# Altium project template.PrjPcb
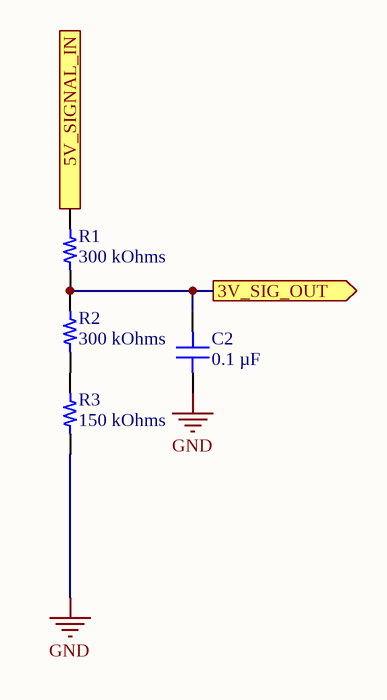
[diagram p0: 5V_TO_3V_VD.SchDoc]
12 sheets, 114 parts. Net scope: hierarchical (ports join the sheet entries above them; power ports are global).
Board file: PCB.PcbDoc
Sheets:
  5V_TO_3V_VD.SchDoc
  12V_SIGNAL_BULKHEAD.SchDoc
  5V_LS.SchDoc
  boardPower.SchDoc
    Buck = Buck.SchDoc
    LDO = LDO.SchDoc
  STM32.SchDoc
    CAN1 = CAN.SchDoc
    CAN2 = CAN.SchDoc
    Accelerometer And Gyro = IMU.SchDoc
  Connectors.SchDoc
  Debugger.SchDoc
    POWER = Power.SchDoc

## Sheet 5V_TO_3V_VD.SchDoc
size A4

### Parts
C2  0.1 µF  [CAP 0805_2012]
R1  300 kOhms  [RES 0805_2012]
R2  300 kOhms  [RES 0805_2012]
R3  150 kOhms  [RES 0805_2012]

### Ports
3V_SIG_OUT (out), 5V_SIGNAL_IN

### Nets
GND: C2.1 R3.1
NetC2_2: C2.2 R1.1 R2.2 ; port 3V_SIG_OUT
NetR1_2: R1.2 ; port 5V_SIGNAL_IN
NetR2_1: R2.1 R3.2

### Library data of the parts
C2 = CC0805MRX7R9BB104: CAP CER 0.1UF 50V X7R 0805; manufacturer: Yageo; Tolerance: ±20%; Part Number: CC0805MRX7R9BB104; Value: 0.1 µF; Applications: General Purpose; Capacitance: 0.1 µF; componentlink1description: Datasheet; componentlink1url: https://www.yageo.com/upload/media/product/productsearch/datasheet/mlcc/UPY-GPHC_X7R_6.3V-to-50V_18.pdf; componentlink2description: DigiKey Link; componentlink2url: https://www.digikey.com/en/products/detail/yageo/CC0805MRX7R9BB104/5884281; Device Package: 0805 (2012 Metric); lastupdated: 2023-10-02 7:13:07 PM; Lifecycle Status: Active; Minimum Order: 1; Mounting Type: Surface Mount, MLCC; Operating Temperature: -55°C ~ 125°C; Package / Case: 0805 (2012 Metric); packaging: TapeAndReel; partid: 2475; Part Status: Active; price: 0.01; series: CC; Size / Dimension: 0.079" L x 0.049" W (2.00mm x 1.25mm); Supplier 1: DigiKey; Supplier Part Number 1: 311-4351-1-ND; Temperature Coefficient: X7R; Thickness (Max): 0.037" (0.95mm); Voltage - Rated: 50V
R1 R2 = CRCW0805300KJNEA: RES SMD 300K OHM 5% 1/8W 0805; Manufacturer: Vishay Dale; Power (Watts): 0.125W, 1/8W; Temperature Coefficient: ±200ppm/°C; Part Number: CRCW0805300KJNEA; Value: 300 kOhms; ComponentLink1Description: Datasheet; ComponentLink1URL: http://www.vishay.com/docs/20035/dcrcwe3.pdf; ComponentLink2Description: DigiKey Link; ComponentLink2URL: https://www.digikey.com/en/products/detail/vishay-dale/CRCW0805300KJNEA/1175257; Composition: Thick Film; Device Package: 0805 (2012 Metric); Features: Automotive AEC-Q200; Height - Seated (Max): 0.020" (0.50mm); LastUpdated: 2023-10-02 7:52:37 PM; Lifecycle Status: Active; Minimum Order: 1; Number of Terminations: 2; Operating Temperature: -55°C ~ 155°C; Package / Case: 0805 (2012 Metric); Packaging: TapeAndReel; PartId: 29510; Part Status: Active; Price: 0.01; Ratings: AEC-Q200; Resistance: 300 kOhms; Series: CRCW; Size / Dimension: 0.079" L x 0.049" W (2.00mm x 1.25mm); Supplier 1: DigiKey; Supplier Part Number 1: 541-300KACT-ND; Supplier Device Package: 0805; Tolerance: ±5%
R3 = RT0805DRD07150KL: RES SMD 150K OHM 0.5% 1/8W 0805; Manufacturer: Yageo; Power (Watts): 0.125W, 1/8W; Temperature Coefficient: ±25ppm/°C; Part Number: RT0805DRD07150KL; Value: 150 kOhms; ComponentLink1Description: Datasheet; ComponentLink1URL: https://www.yageo.com/upload/media/product/productsearch/datasheet/rchip/PYu-RT_1-to-0.01_RoHS_L_11.pdf; ComponentLink2Description: DigiKey Link; ComponentLink2URL: https://www.digikey.com/en/products/detail/yageo/RT0805DRD07150KL/1077874; Composition: Thin Film; Device Package: 0805 (2012 Metric); Height - Seated (Max): 0.024" (0.60mm); LastUpdated: 2023-10-02 7:52:44 PM; Lifecycle Status: Active; Minimum Order: 1; Number of Terminations: 2; Operating Temperature: -55°C ~ 155°C; Package / Case: 0805 (2012 Metric); Packaging: TapeAndReel; PartId: 27806; Part Status: Active; Price: 0.02; Resistance: 150 kOhms; Series: RT; Size / Dimension: 0.079" L x 0.049" W (2.00mm x 1.25mm); Supplier 1: DigiKey; Supplier Part Number 1: 311-2706-1-ND; Supplier Device Package: 0805; Tolerance: ±0.5%

## Sheet 12V_SIGNAL_BULKHEAD.SchDoc
size A4
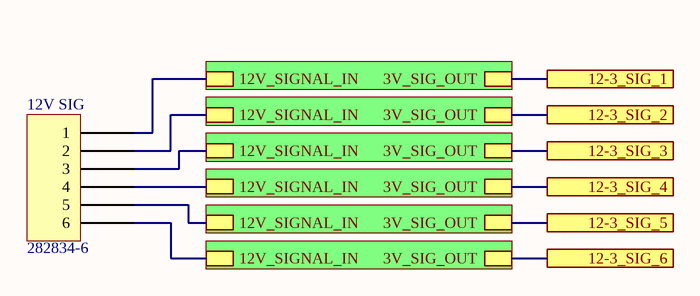
[diagram p1: 12V_SIGNAL_BULKHEAD.SchDoc]

### Parts
12V_SIG  282834-6  [TE 282834-6]

### Sub-sheets
? = 12_TO_3V3_VOLTAGE_DIVIDER.SchDoc (file not in this document): 12V_SIGNAL_IN, 3V_SIG_OUT
? = 12_TO_3V3_VOLTAGE_DIVIDER.SchDoc (file not in this document): 12V_SIGNAL_IN, 3V_SIG_OUT
? = 12_TO_3V3_VOLTAGE_DIVIDER.SchDoc (file not in this document): 12V_SIGNAL_IN, 3V_SIG_OUT
? = 12_TO_3V3_VOLTAGE_DIVIDER.SchDoc (file not in this document): 12V_SIGNAL_IN, 3V_SIG_OUT
? = 12_TO_3V3_VOLTAGE_DIVIDER.SchDoc (file not in this document): 12V_SIGNAL_IN, 3V_SIG_OUT
? = 12_TO_3V3_VOLTAGE_DIVIDER.SchDoc (file not in this document): 12V_SIGNAL_IN, 3V_SIG_OUT

### Ports
12-3_SIG_1, 12-3_SIG_2, 12-3_SIG_3, 12-3_SIG_4, 12-3_SIG_5, 12-3_SIG_6

### Nets
Net12V_SIG_1: 12V_SIG.1 ; sheet /12V_SIGNAL_IN
Net12V_SIG_2: 12V_SIG.2 ; sheet /12V_SIGNAL_IN
Net12V_SIG_3: 12V_SIG.3 ; sheet /12V_SIGNAL_IN
Net12V_SIG_4: 12V_SIG.4 ; sheet /12V_SIGNAL_IN
Net12V_SIG_5: 12V_SIG.5 ; sheet /12V_SIGNAL_IN
Net12V_SIG_6: 12V_SIG.6 ; sheet /12V_SIGNAL_IN
(unnamed): port 12-3_SIG_1, sheet /3V_SIG_OUT
(unnamed): port 12-3_SIG_2, sheet /3V_SIG_OUT
(unnamed): port 12-3_SIG_3, sheet /3V_SIG_OUT
(unnamed): port 12-3_SIG_4, sheet /3V_SIG_OUT
(unnamed): port 12-3_SIG_5, sheet /3V_SIG_OUT
(unnamed): port 12-3_SIG_6, sheet /3V_SIG_OUT

### Library data of the parts
12V_SIG = 282834-6: TERM BLK 6P SIDE ENT 2.54MM PCB; Manufacturer: TE Connectivity AMP Connectors; Current: 10A; Mating Orientation: Horizontal with Board; Number of Levels: 1; Pitch: 0.100" (2.54mm); Positions Per Level: 6; Voltage: 150V; Wire Gauge: 16-30 AWG; Wire Termination: Screw - Rising Cage Clamp; Part Number: 282834-6; Color: Green; ComponentLink1Description: Datasheet; ComponentLink1URL: https://www.te.com/commerce/DocumentDelivery/DDEController?Action=srchrtrv&DocNm=282834&DocType=Customer+Drawing&DocLang=English; ComponentLink2Description: DigiKey Link; ComponentLink2URL: http://digikey.com/product-detail/en/te-connectivity-amp-connectors/282834-6/A98337-ND/1153267; LastUpdated: 2020-01-15 4:16:31 AM; Lifecycle Status: Active; Minimum Order: 1; Mounting Type: Through Hole; Packaging: Bulk; Part Status: Active; Price: 4.72; Series: Buchanan; Supplier 1: DigiKey; Supplier Part Number 1: A98337-ND

## Sheet 5V_LS.SchDoc
size A4
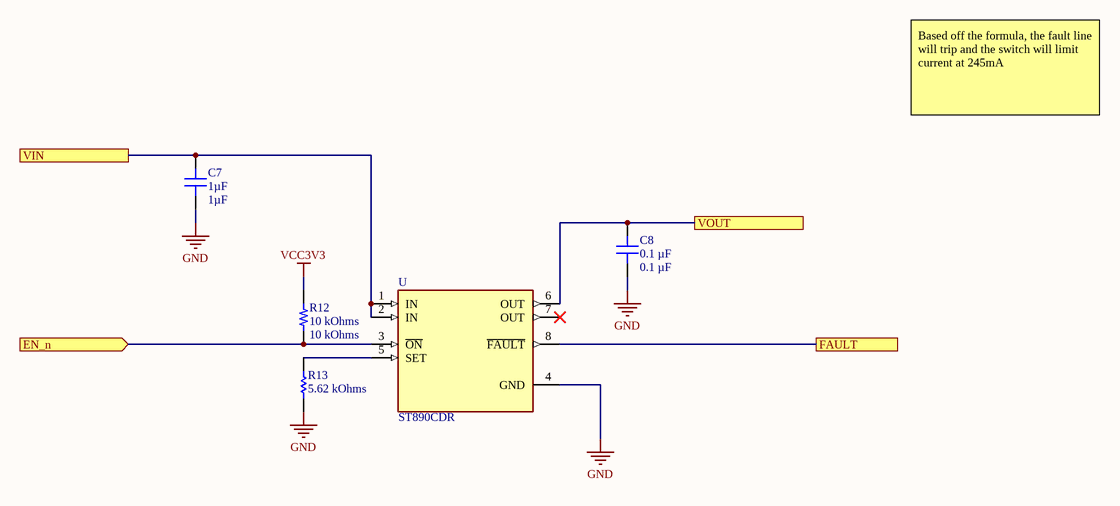
[diagram p2: 5V_LS.SchDoc]

### Parts
C7  1µF  [CAP 0805_2012]
C8  0.1 µF  [CAP 0805_2012]
R12  10 kOhms  [RES 0805_2012]
R13  5.62 kOhms  [RESC2013X60X40ML20T25]
U  ST890CDR  [SOIC127P600X175-8N]

### Ports
EN_n (in), FAULT, VIN, VOUT

### Nets
GND: C7.1 C8.1 R13.1 U.4(GND)
VCC3V3: R12.2
NetC7_2: C7.2 U.1(IN) U.2(IN) ; port VIN
NetC8_2: C8.2 U.6(OUT) ; port VOUT
NetR12_1: R12.1 U.3(~{ON}) ; port EN_n
NetR13_2: R13.2 U.5(SET)
NetU_8: U.8(~{FAULT}) ; port FAULT

Not connected (* = marked no-connect by the designer): U 7(OUT)*

### Notes on the sheet
- Based off the formula, the fault line will trip and the switch will limit current at 245mA

### Library data of the parts
C7 = MM05ZC105KCZ2A: CAP CER 1UF 10V X7R 0805; Part Number: MM05ZC105KCZ2A; Value: 1µF
C8 = CC0805MRX7R9BB104: CAP CER 0.1UF 50V X7R 0805; Part Number: CC0805MRX7R9BB104; Value: 0.1 µF
R12 = RNCS0805BKE10K0: RES 10K OHM 0.1% 1/10W 0805; Part Number: RNCS0805BKE10K0; Value: 10 kOhms
R13 = CMP-2001-00852-1: Part Number: ERA6AEB5621V; Manufacturer: Panasonic
U = ST890CDR: Power Switch/Driver 1:1 P-Channel 1.2A 8-SO; MF: STMicroelectronics; SnapEDA_Link: https://www.snapeda.com/parts/ST890CDR/STMicroelectronics/view-part/496092/?ref=snap; Availability: Unavailable; Price: None; MP: ST890CDR; Package: SOIC-8 STMicroelectronics; Value: *

## Sheet boardPower.SchDoc
size A4
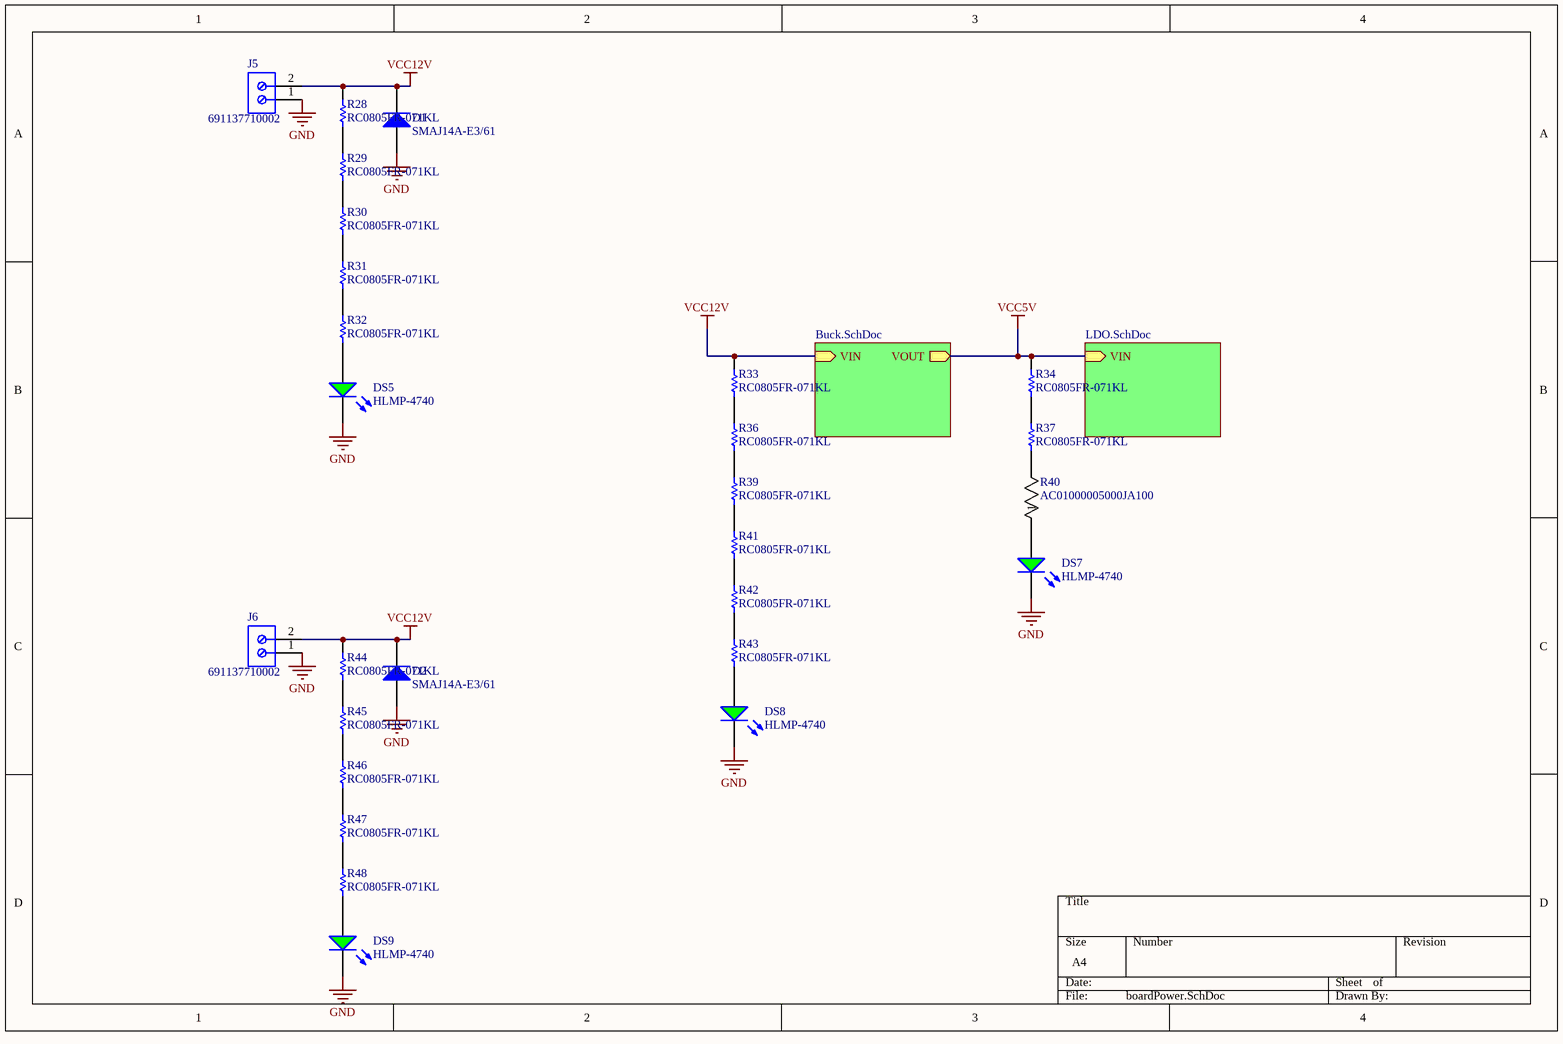
[diagram p3: boardPower.SchDoc]

### Parts
D1  SMAJ14A-E3/61  [VISH-DO-214AC-2_L]
D2  SMAJ14A-E3/61  [VISH-DO-214AC-2_L]
DS5  HLMP-4740  [AVAG-HLMP-4740]
DS7  HLMP-4740  [AVAG-HLMP-4740]
DS8  HLMP-4740  [AVAG-HLMP-4740]
DS9  HLMP-4740  [AVAG-HLMP-4740]
J5  691137710002  [691137710002]
J6  691137710002  [691137710002]
R28  RC0805FR-071KL  [RESC2013X60X35ML10T20]
R29  RC0805FR-071KL  [RESC2013X60X35ML10T20]
R30  RC0805FR-071KL  [RESC2013X60X35ML10T20]
R31  RC0805FR-071KL  [RESC2013X60X35ML10T20]
R32  RC0805FR-071KL  [RESC2013X60X35ML10T20]
R33  RC0805FR-071KL  [RESC2013X60X35ML10T20]
R34  RC0805FR-071KL  [RESC2013X60X35ML10T20]
R36  RC0805FR-071KL  [RESC2013X60X35ML10T20]
R37  RC0805FR-071KL  [RESC2013X60X35ML10T20]
R39  RC0805FR-071KL  [RESC2013X60X35ML10T20]
R40  AC01000005000JA100  [RES_AC01_VIS]
R41  RC0805FR-071KL  [RESC2013X60X35ML10T20]
R42  RC0805FR-071KL  [RESC2013X60X35ML10T20]
R43  RC0805FR-071KL  [RESC2013X60X35ML10T20]
R44  RC0805FR-071KL  [RESC2013X60X35ML10T20]
R45  RC0805FR-071KL  [RESC2013X60X35ML10T20]
R46  RC0805FR-071KL  [RESC2013X60X35ML10T20]
R47  RC0805FR-071KL  [RESC2013X60X35ML10T20]
R48  RC0805FR-071KL  [RESC2013X60X35ML10T20]

### Sub-sheets
Buck = Buck.SchDoc: VIN (in), VOUT (out)
LDO = LDO.SchDoc: VIN (in)

### Nets
GND: D1.2(A) D2.2(A) DS5.2(K) DS7.2(K) DS8.2(K) DS9.2(K) J5.1 J6.1 R34.2 ; sheet Buck/VOUT, sheet LDO/VIN  [also labelled VCC5V]
VCC12V: D1.1(K) D2.1(K) J5.2 J6.2 R28.2 R33.2 R44.2 ; sheet Buck/VIN
NetDS5_1: DS5.1(A) R32.1
NetDS7_1: DS7.1(A) R40.1
NetDS8_1: DS8.1(A) R43.1
NetDS9_1: DS9.1(A) R48.1
NetR28_1: R28.1 R29.2
NetR29_1: R29.1 R30.2
NetR30_1: R30.1 R31.2
NetR31_1: R31.1 R32.2
NetR33_1: R33.1 R36.2
NetR34_1: R34.1 R37.2
NetR36_1: R36.1 R39.2
NetR37_1: R37.1 R40.2
NetR39_1: R39.1 R41.2
NetR41_1: R41.1 R42.2
NetR42_1: R42.1 R43.2
NetR44_1: R44.1 R45.2
NetR45_1: R45.1 R46.2
NetR46_1: R46.1 R47.2
NetR47_1: R47.1 R48.2

### Library data of the parts
D1 D2 = CMP-0548-00224-2: Transient Voltage Suppressor, 6.40 to 231 V, 14 V Stand-off Voltage, Uni-Directional, -55 to 155 degC, 2-pin DO-214AC, Pb-Free, Tape and Reel; Manufacturer: Vishay Semiconductor; PPPM (W): 400, 300; VWM (V): 14; VBR Uni-Directional (V): 6.4 to 231; IFSM: 40 A; ID (uA): 1; PackageDescription: 2-Pin DO-214AC (SMA), Body 4.245 x 2.665 mm; ComponentLink2URL: http://www.vishay.com/docs/88390/smaj50a.pdf; Mounting Technology: Surface Mount; PartNumber: SMAJ14A-E3/61; Operating Junction and Storage Temperature Range: -55 to 150 degC; ComponentLink2Description: Datasheet; Packing: Tape and Reel; PackageReference: DO-214AC-2; ComponentLink3Description: Package Specification; ComponentLink1URL: http://www.vishay.com/; RoHS: TRUE; ComponentLink3URL: http://www.vishay.com/docs/88390/smaj50a.pdf; ComponentLink1Description: Manufacturer URL; DatasheetVersion: 12/8/2013
DS5 DS7-DS9 = CMP-2000-06413-1: T-1 3/4 (5 mm) Low Current LED Lamp, Green, 1.9 V, -20 to 100 degC, 2-Pin THD, RoHS, Bulk; Manufacturer: AvagoTechnologies; Type: Uni-Color; Peak Wavelength: 565nm; Rad Hard: No; Viewing Angle: 50°; Dominant Wavelength/Color Temperature: 569nm; Number of LEDs: 1; Lens Appearance: ColoredDiffused; Lens Shape Type: Circular; Mounting Orientation: TopMount; Intensity: 2.3mcd; Datasheet Version: 07/2014; Category: LEDs; Datasheet URL: http://docs.avagotech.com/docs/AV02-1557EN; Packaging: Bulk; Pin Count: 2; Mounting Technology: ThroughHole; Package Reference: HLMP-4740; Mounting: ThroughHole; Manufacturer URL: http://www.avagotech.com/; Color: Green; Package: 2T-13/4; Package Description: 2-Pin Through Hole Device, Dia 5.845 mm, Pitch 2.54 mm
J5 J6 = CMP-1502-03324-2: NexarPartId: 78871135; Voltage Rating: 300V; Number of Contacts: 2; Current Rating: 16A; Lead Pitch: 5mm; Height: 11.6mm; Packaging: Box; RoHS: Non-Compliant; Contact Material: Nickel, Tin; Max Operating Temperature: 120°C; Number of Pins: 2; Min Operating Temperature: -30°C; Number of Rows: 1
R28-R34 R36 R37 R39 R41-R48 = CMP-2100-03671-1: Chip Resistor, 1 KOhm, +/- 1%, 125 mW, -55 to 155 degC, 0805 (2012 Metric), RoHS, Tape and Reel; Manufacturer: Yageo; Temperature Coefficient: 100ppm/degreesC; Voltage Rating (DC): 150V; Max Power Dissipation: 125mW; Resistance: 1KOhm; Number of Pins: 2; Number of Terminations: 2; Datasheet URL: http://www.yageo.com/NewPortal/yageodocoutput?fileName=/pdf/R-Chip/PYu-RC_Group_51_RoHS_L_5.pdf; Length: 0.079inch; Package Description: 2-Pin Surface Mounted Device, Body 2 x 1.25 mm; Depth: 1.25mm; Height: 0.024inch; Military Standard: Not; Case/Package: 0805; Package Reference: 0805; RoHSCompliant: true; Lead Free: LeadFree; Packaging: TapeandReel; Package Quantity: 1; Datasheet Version: Rev. 5, 10/2016; Tolerance: 1%; Min Operating Temperature: -55degC; Voltage Rating: 150V; Composition: ThickFilm; Case Code (Imperial): 0805; Power Rating: 125mW; Width: 0.049inch; Case Code (Metric): 2012; Manufacturer URL: http://www.yageo.com/; Max Operating Temperature: 155degC; REACH SVHC: Unknown; Termination: SMD/SMT
R40 = CMP-00030-39746512-1: AC01000005000JA100 Res Wirewound 500 Ohm 5% 1W 100ppm/°C to 180ppm/°C Conformal AXL Thru-Hole Ammo Pack; Voltage Rating (DC): 22V; Lead Diameter: 800µm; Resistance: 500Ω; Weight: 519.986953mg; Number of Pins: 2; Min Operating Temperature: -40°C; Case/Package: Axial; Schedule B: 8533210080, 8533210080; Features: Flame Retardant Coating; Power Rating: 1W; Max Power Dissipation: 1W; Packaging: Tape & Box (TB); RoHS: Compliant; REACH SVHC: Unknown; NexarPartId: 39746512; Temperature Coefficient: 180ppm/°C; Diameter: 4.3mm; Contact Plating: Tin; Radiation Hardening: No; Max Operating Temperature: 275°C; Length: 11mm; Tolerance: 5%; Composition: Wirewound; Number of Terminations: 2; Termination: Axial; Voltage Rating: 22V

## Sheet Buck.SchDoc
size A4
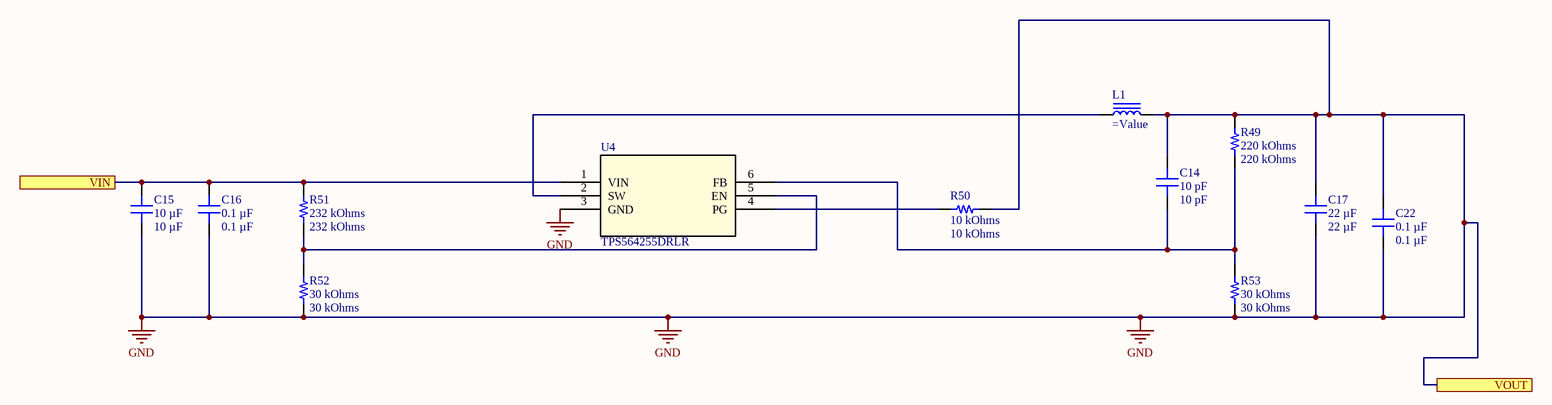
[diagram p4: Buck.SchDoc]

### Parts
C14  10 pF  [CAP 0805_2012]
C15  10 µF  [CAP 0805_2012]
C16  0.1 µF  [CAP 0805_2012]
C17  22 µF  [CAP 0805_2012]
C22  0.1 µF  [CAP 0805_2012]
L1  (no value)  [WURTH WE-PD 1245]
R49  220 kOhms  [RES 0805_2012]
R50  10 kOhms  [RES 0805_2012]
R51  232 kOhms  [RES 0805_2012]
R52  30 kOhms  [RES 0805_2012]
R53  30 kOhms  [RES 0805_2012]
U4  TPS564255DRLR  [TPS564242DRLR_TEX]

### Ports
VIN, VOUT

### Nets
GND: C14.2 C15.1 C16.1 C17.1 C17.2 C22.1 C22.2 L1.2 R49.2 R50.2 R52.1 R53.1 U4.3(GND) ; port VOUT
VCC12V: C15.2 C16.2 R51.2 U4.1(VIN) ; port VIN
NetC14_1: C14.1 R49.1 R53.2 U4.6(FB)
NetL1_1: L1.1 U4.2(SW)
NetR50_1: R50.1 U4.4(PG)
NetR51_1: R51.1 R52.2 U4.5(EN)

### Library data of the parts
C14 = GQM2195C2E100JB12D: CAP CER 10PF 250V C0G/NP0 0805; Part Number: GQM2195C2E100JB12D; Value: 10 pF
C15 = CL21Y106KPQVPNE: CAP CER 10UF 10V X7S 0805; Part Number: CL21Y106KPQVPNE; Value: 10 µF
C16 C22 = CC0805MRX7R9BB104: CAP CER 0.1UF 50V X7R 0805; Part Number: CC0805MRX7R9BB104; Value: 0.1 µF
C17 = CL21A226KOQNNNE: CAP CER 22UF 16V X5R 0805; Part Number: CL21A226KOQNNNE; Value: 22 µF
L1 = 7447715004: FIXED IND 4.7UH 5.2A 16 MOHM SMD; Part Number: 7447715004
R49 = CRGP0805F220K: RES 220K OHM 1% 1/3W 0805; Part Number: CRGP0805F220K; Value: 220 kOhms
R50 = RNCS0805BKE10K0: RES 10K OHM 0.1% 1/10W 0805; Part Number: RNCS0805BKE10K0; Value: 10 kOhms
R51 = CRCW0805232KFKEA: RES SMD 232K OHM 1% 1/8W 0805; Part Number: CRCW0805232KFKEA; Value: 232 kOhms
R52 R53 = RNCF0805DTE30K0: RES 30K OHM 0.5% 1/8W 0805; Part Number: RNCF0805DTE30K0; Value: 30 kOhms
U4 = TPS564255DRLR: No Description Available; Mfr_Name: Texas Instruments; Type: DEV; Copyright: Copyright (C) 2023 Ultra Librarian. All rights reserved.; Manufacturer_Part_Number: TPS564255DRLR; RefDes: RefDes

## Sheet LDO.SchDoc
size A4
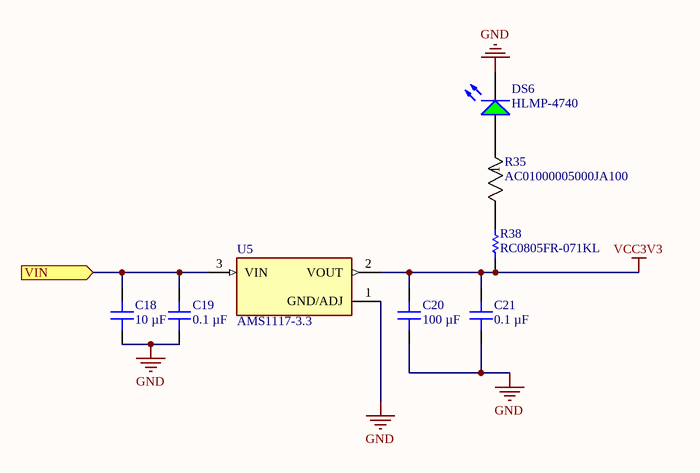
[diagram p5: LDO.SchDoc]

### Parts
C18  10 µF  [CAP 0805_2012]
C19  0.1 µF  [CAP 0805_2012]
C20  100 µF  [CAP 0805_2012]
C21  0.1 µF  [CAP 0805_2012]
DS6  HLMP-4740  [AVAG-HLMP-4740]
R35  AC01000005000JA100  [RES_AC01_VIS]
R38  RC0805FR-071KL  [RESC2013X60X35ML10T20]
U5  AMS1117-3.3  [SOT229P700X180-4N]

### Ports
VIN (in)

### Nets
GND: C18.1 C18.2 C19.1 C19.2 C20.1 C21.1 DS6.2(K) U5.1(GND/ADJ) U5.3(VIN) ; port VIN
VCC3V3: C20.2 C21.2 R38.2 U5.2(VOUT)
NetDS6_1: DS6.1(A) R35.1
NetR35_2: R35.2 R38.1

### Library data of the parts
C18 = C2012X6S1C106K125AC: CAP CER 10UF 16V X6S 0805; manufacturer: TDK Corporation; Tolerance: ±10%; Part Number: C2012X6S1C106K125AC; Value: 10 µF; Applications: General Purpose; Capacitance: 10 µF; componentlink1description: Datasheet; componentlink1url: https://product.tdk.com/info/en/catalog/datasheets/mlcc_commercial_general_en.pdf?ref_disty=digikey; componentlink2description: DigiKey Link; componentlink2url: https://www.digikey.com/en/products/detail/tdk-corporation/C2012X6S1C106K125AC/2733046; Device Package: 0805 (2012 Metric); Features: Low ESL; lastupdated: 2023-10-02 7:13:05 PM; Lifecycle Status: Active; Minimum Order: 1; Mounting Type: Surface Mount, MLCC; Operating Temperature: -55°C ~ 105°C; Package / Case: 0805 (2012 Metric); packaging: TapeAndReel; partid: 2995; Part Status: Active; price: 0.07; series: C; Size / Dimension: 0.079" L x 0.049" W (2.00mm x 1.25mm); Supplier 1: DigiKey; Supplier Part Number 1: 445-7611-1-ND; Temperature Coefficient: X6S; Thickness (Max): 0.057" (1.45mm); Voltage - Rated: 16V
C19 C21 = CC0805MRX7R9BB104: as C2 on sheet 5V_TO_3V_VD; Part Number: CC0805MRX7R9BB104; Value: 0.1 µF; Applications: General Purpose; Capacitance: 0.1 µF; componentlink1description: Datasheet; componentlink1url: https://www.yageo.com/upload/media/product/productsearch/datasheet/mlcc/UPY-GPHC_X7R_6.3V-to-50V_18.pdf; componentlink2description: DigiKey Link; componentlink2url: https://www.digikey.com/en/products/detail/yageo/CC0805MRX7R9BB104/5884281; Device Package: 0805 (2012 Metric); lastupdated: 2023-10-02 7:13:07 PM; Lifecycle Status: Active; Minimum Order: 1; Mounting Type: Surface Mount, MLCC; Operating Temperature: -55°C ~ 125°C; Package / Case: 0805 (2012 Metric); packaging: TapeAndReel; partid: 2475; Part Status: Active; price: 0.01; series: CC; Size / Dimension: 0.079" L x 0.049" W (2.00mm x 1.25mm); Supplier 1: DigiKey; Supplier Part Number 1: 311-4351-1-ND; Temperature Coefficient: X7R; Thickness (Max): 0.037" (0.95mm); Voltage - Rated: 50V
C20 = PMK212BBJ107MG-T: CAP CER 100UF 2.5V X5R 0805; manufacturer: Taiyo Yuden; Tolerance: ±20%; Part Number: PMK212BBJ107MG-T; Value: 100 µF; Applications: SMPS Filtering; Capacitance: 100 µF; componentlink1description: Datasheet; componentlink1url: https://ds.yuden.co.jp/TYCOMPAS/ut/detail?pn=PMK212BBJ107MG-T  &u=M; componentlink2description: DigiKey Link; componentlink2url: https://www.digikey.com/en/products/detail/taiyo-yuden/PMK212BBJ107MG-T/4950524; Device Package: 0805 (2012 Metric); lastupdated: 2023-10-02 7:12:56 PM; Lifecycle Status: Active; Minimum Order: 1; Mounting Type: Surface Mount, MLCC; Operating Temperature: -55°C ~ 85°C; Package / Case: 0805 (2012 Metric); packaging: TapeAndReel; partid: 7580; Part Status: Active; price: 0.48; series: M; Size / Dimension: 0.079" L x 0.049" W (2.00mm x 1.25mm); Supplier 1: DigiKey; Supplier Part Number 1: 587-3978-1-ND; Temperature Coefficient: X5R; Thickness (Max): 0.053" (1.35mm); Voltage - Rated: 2.5V
DS6 = CMP-2000-06413-1: as DS5 on sheet boardPower; Datasheet Version: 07/2014; Category: LEDs; Datasheet URL: http://docs.avagotech.com/docs/AV02-1557EN; Packaging: Bulk; Pin Count: 2; Mounting Technology: ThroughHole; Package Reference: HLMP-4740; Mounting: ThroughHole; Manufacturer URL: http://www.avagotech.com/; Color: Green; Package: 2T-13/4; Package Description: 2-Pin Through Hole Device, Dia 5.845 mm, Pitch 2.54 mm
R35 = CMP-00030-39746512-1: as R40 on sheet boardPower; Weight: 519.986953mg; Number of Pins: 2; Min Operating Temperature: -40°C; Case/Package: Axial; Schedule B: 8533210080, 8533210080; Features: Flame Retardant Coating; Power Rating: 1W; Max Power Dissipation: 1W; Packaging: Tape & Box (TB); RoHS: Compliant; REACH SVHC: Unknown; NexarPartId: 39746512; Temperature Coefficient: 180ppm/°C; Diameter: 4.3mm; Contact Plating: Tin; Radiation Hardening: No; Max Operating Temperature: 275°C; Length: 11mm; Tolerance: 5%; Composition: Wirewound; Number of Terminations: 2; Termination: Axial; Voltage Rating: 22V
R38 = CMP-2100-03671-1: as R28 on sheet boardPower; Number of Pins: 2; Number of Terminations: 2; Datasheet URL: http://www.yageo.com/NewPortal/yageodocoutput?fileName=/pdf/R-Chip/PYu-RC_Group_51_RoHS_L_5.pdf; Length: 0.079inch; Package Description: 2-Pin Surface Mounted Device, Body 2 x 1.25 mm; Depth: 1.25mm; Height: 0.024inch; Military Standard: Not; Case/Package: 0805; Package Reference: 0805; RoHSCompliant: true; Lead Free: LeadFree; Packaging: TapeandReel; Package Quantity: 1; Datasheet Version: Rev. 5, 10/2016; Tolerance: 1%; Min Operating Temperature: -55degC; Voltage Rating: 150V; Composition: ThickFilm; Case Code (Imperial): 0805; Power Rating: 125mW; Width: 0.049inch; Case Code (Metric): 2012; Manufacturer URL: http://www.yageo.com/; Max Operating Temperature: 155degC; REACH SVHC: Unknown; Termination: SMD/SMT
U5 = AMS1117-3.3: Sot223/Pkg 1-Amp 3.3-Volt Low Drop Out Voltage Regulatator; MF: Advanced Monolithic Systems; Package: SOT-223 Seeed Technology; Value: *; Check_prices: https://www.snapeda.com/parts/AMS1117-3.3/Advanced+Monolithic+Systems/view-part/?ref=eda; Price: None; Availability: Not in stock; MP: AMS1117-3.3; SnapEDA_Link: https://www.snapeda.com/parts/AMS1117-3.3/Advanced+Monolithic+Systems/view-part/?ref=snap

## Sheet STM32.SchDoc
size A4
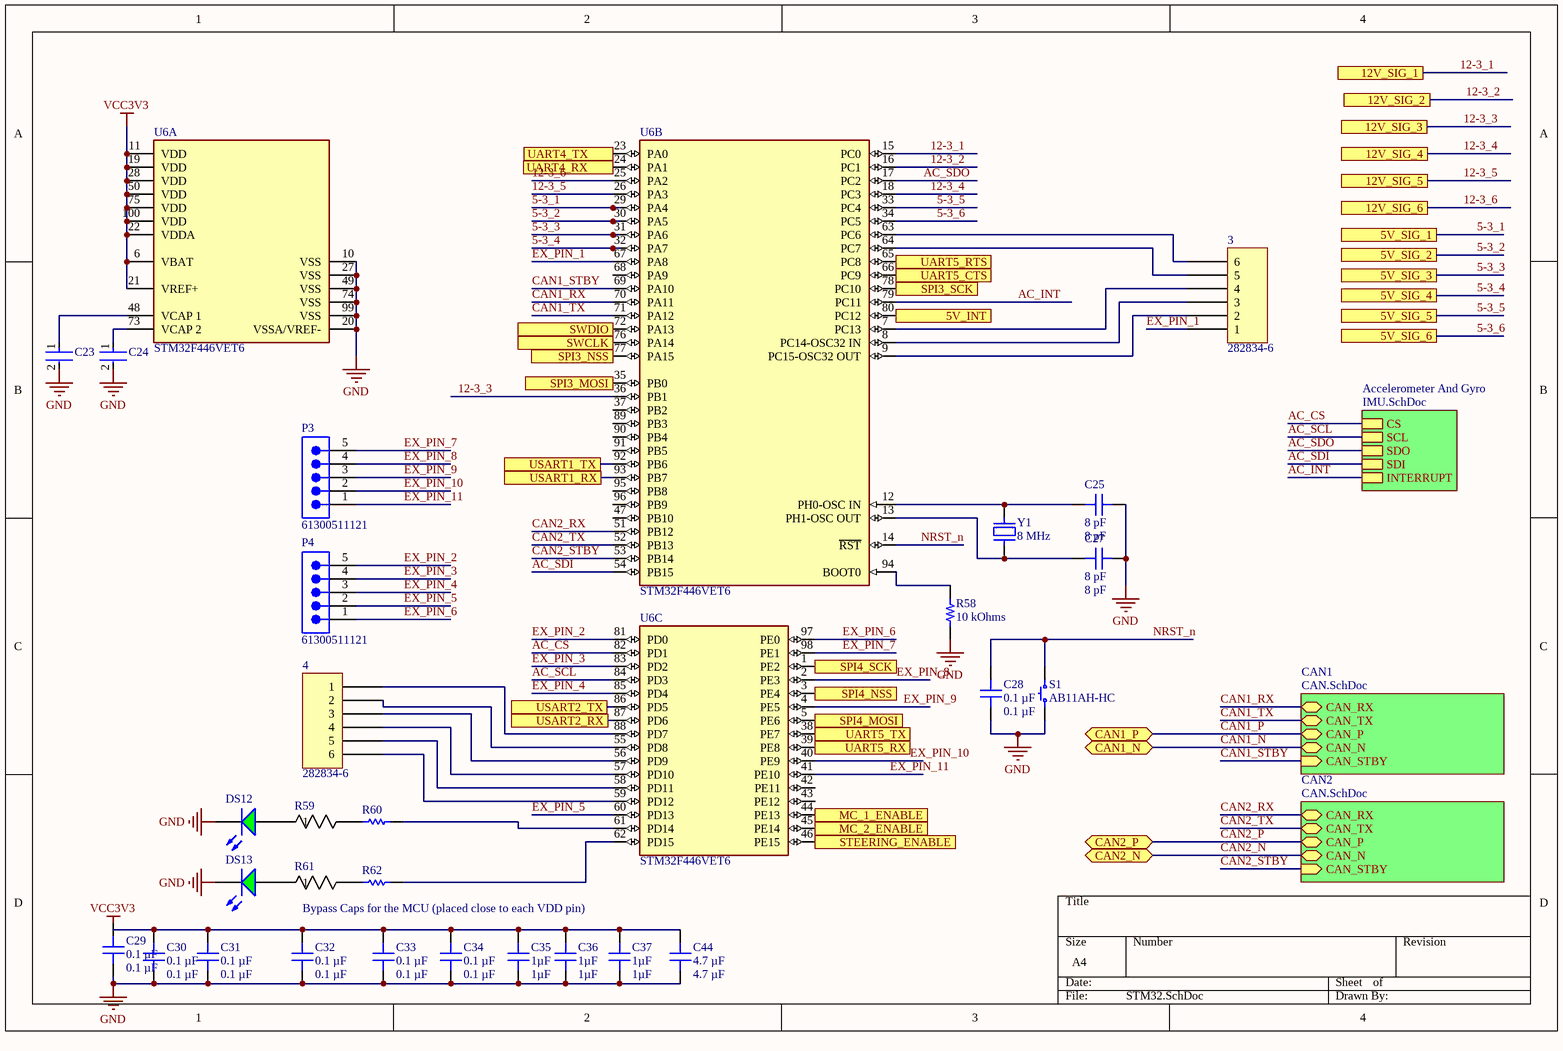
[diagram p6: STM32.SchDoc]

### Parts
3  282834-6  [TE 282834-6]
4  282834-6  [TE 282834-6]
C23  GRM188R71A225KE15D  [FP-GRM188-0_1-e0_2_0_5-MFG]  (value not drawn)
C24  GRM188R71A225KE15D  [FP-GRM188-0_1-e0_2_0_5-MFG]  (value not drawn)
C25  8 pF  [CAP 0805_2012]
C27  8 pF  [CAP 0805_2012]
C28  0.1 µF  [CAP 0805_2012]
C29  0.1 µF  [CAP 0805_2012]
C30  0.1 µF  [CAP 0805_2012]
C31  0.1 µF  [CAP 0805_2012]
C32  0.1 µF  [CAP 0805_2012]
C33  0.1 µF  [CAP 0805_2012]
C34  0.1 µF  [CAP 0805_2012]
C35  1µF  [CAP 0805_2012]
C36  1µF  [CAP 0805_2012]
C37  1µF  [CAP 0805_2012]
C44  4.7 µF  [CAP 0805_2012]
DS12  HLMP-4740  [AVAG-HLMP-4740]  (value not drawn)
DS13  HLMP-4740  [AVAG-HLMP-4740]  (value not drawn)
P3  61300511121  [61300511121]
P4  61300511121  [61300511121]
R58  10 kOhms  [RES 0805_2012]
R59  AC01000005000JA100  [RES_AC01_VIS]  (value not drawn)
R60  RC0805FR-071KL  [RESC2013X60X35ML10T20]  (value not drawn)
R61  AC01000005000JA100  [RES_AC01_VIS]  (value not drawn)
R62  RC0805FR-071KL  [RESC2013X60X35ML10T20]  (value not drawn)
S1  AB11AH-HC  [NKK AB11AH-HC]
U6  STM32F446VET6  [FP-LQFP100-1L-MFG]  (parts A,B,C of 3)
Y1  8 MHz  [ABRACON ABLS]

### Sub-sheets
Accelerometer And Gyro = IMU.SchDoc: CS, SCL, SDO, SDI, INTERRUPT
CAN1 = CAN.SchDoc: CAN_RX (bidir), CAN_TX (bidir), CAN_STBY (in), CAN_P (bidir), CAN_N (bidir)
CAN2 = CAN.SchDoc: CAN_RX (bidir), CAN_TX (bidir), CAN_STBY (in), CAN_P (bidir), CAN_N (bidir)

### Ports
5V_INT, 5V_SIG_1, 5V_SIG_2, 5V_SIG_3, 5V_SIG_4, 5V_SIG_5, 5V_SIG_6, 12V_SIG_1, 12V_SIG_2, 12V_SIG_3, 12V_SIG_4, 12V_SIG_5, 12V_SIG_6, CAN1_N (bidir), CAN1_P (bidir), CAN2_N (bidir), CAN2_P (bidir), MC_1_ENABLE, MC_2_ENABLE, SPI3_MOSI, SPI3_NSS, SPI3_SCK, SPI4_MOSI, SPI4_NSS, SPI4_SCK, STEERING_ENABLE, SWCLK, SWDIO, UART4_RX, UART4_TX, UART5_CTS, UART5_RTS, UART5_RX, UART5_TX, USART1_RX, USART1_TX, USART2_RX, USART2_TX

### Nets
GND: C23.2 C24.2 C25.2 C27.2 C28.1 C29.1 C30.1 C31.1 C32.1 C33.1 C34.1 C35.1 C36.1 C37.1 C44.1 DS12.2(K) DS13.2(K) R58.1 S1.1 U6.10(VSS) U6.20(VSSA/VREF-) U6.27(VSS) U6.49(VSS) U6.74(VSS) U6.99(VSS)
VCC3V3: C30.2 C31.2 C32.2 C33.2 C34.2 C35.2 C36.2 C37.2 C44.2 U6.6(VBAT) U6.11(VDD) U6.19(VDD) U6.21(VREF+) U6.22(VDDA) U6.28(VDD) U6.50(VDD) U6.75(VDD) U6.100(VDD)
5-3_1: U6.29(PA4) ; port 5V_SIG_1
5-3_2: U6.30(PA5) ; port 5V_SIG_2
5-3_3: U6.31(PA6) ; port 5V_SIG_3
5-3_4: U6.32(PA7) ; port 5V_SIG_4
5-3_5: U6.33(PC4) ; port 5V_SIG_5
5-3_6: U6.34(PC5) ; port 5V_SIG_6
12-3_1: U6.15(PC0) ; port 12V_SIG_1
12-3_2: U6.16(PC1) ; port 12V_SIG_2
12-3_3: U6.36(PB1) ; port 12V_SIG_3
12-3_4: U6.18(PC3) ; port 12V_SIG_4
12-3_5: U6.26(PA3) ; port 12V_SIG_5
12-3_6: U6.25(PA2) ; port 12V_SIG_6
AC_CS: U6.82(PD1) ; sheet Accelerometer And Gyro/CS
AC_INT: U6.79(PC11) ; sheet Accelerometer And Gyro/INTERRUPT
AC_SCL: U6.84(PD3) ; sheet Accelerometer And Gyro/SCL
AC_SDI: U6.54(PB15) ; sheet Accelerometer And Gyro/SDI
AC_SDO: U6.17(PC2) ; sheet Accelerometer And Gyro/SDO
CAN1_N: port CAN1_N, sheet CAN1/CAN_N
CAN1_P: port CAN1_P, sheet CAN1/CAN_P
CAN1_RX: U6.70(PA11) ; sheet CAN1/CAN_RX
CAN1_STBY: U6.69(PA10) ; sheet CAN1/CAN_STBY
CAN1_TX: U6.71(PA12) ; sheet CAN1/CAN_TX
CAN2_N: port CAN2_N, sheet CAN2/CAN_N
CAN2_P: port CAN2_P, sheet CAN2/CAN_P
CAN2_RX: U6.51(PB12) ; sheet CAN2/CAN_RX
CAN2_STBY: U6.53(PB14) ; sheet CAN2/CAN_STBY
CAN2_TX: U6.52(PB13) ; sheet CAN2/CAN_TX
EX_PIN_1: 3.1 U6.67(PA8)
EX_PIN_2: P4.5 U6.81(PD0)
EX_PIN_3: P4.4 U6.83(PD2)
EX_PIN_4: P4.3 U6.85(PD4)
EX_PIN_5: P4.2 U6.60(PD13)
EX_PIN_6: P4.1 U6.97(PE0)
EX_PIN_7: P3.5 U6.98(PE1)
EX_PIN_8: P3.4 U6.2(PE3)
EX_PIN_9: P3.3 U6.4(PE5)
EX_PIN_10: P3.2 U6.40(PE9)
EX_PIN_11: P3.1 U6.41(PE10)
NRST_n: C28.2 S1.2 U6.14(~{RST})
Net3_2: 3.2 U6.9(PC15-OSC32_OUT)
Net3_3: 3.3 U6.8(PC14-OSC32_IN)
Net3_4: 3.4 U6.7(PC13)
Net3_5: 3.5 U6.64(PC7)
Net3_6: 3.6 U6.63(PC6)
Net4_1: 4.1 U6.88(PD7)
Net4_2: 4.2 U6.55(PD8)
Net4_3: 4.3 U6.56(PD9)
Net4_4: 4.4 U6.57(PD10)
Net4_5: 4.5 U6.58(PD11)
Net4_6: 4.6 U6.59(PD12)
NetC23_1: C23.1 U6.48(VCAP_1)
NetC24_1: C24.1 U6.73(VCAP_2)
NetC25_1: C25.1 U6.12(PH0-OSC_IN) Y1.2
NetC27_1: C27.1 U6.13(PH1-OSC_OUT) Y1.1
NetDS12_1: DS12.1(A) R59.1
NetDS13_1: DS13.1(A) R61.1
NetR58_2: R58.2 U6.94(BOOT0)
NetR59_2: R59.2 R60.1
NetR60_2: R60.2 U6.61(PD14)
NetR61_2: R61.2 R62.1
NetR62_2: R62.2 U6.62(PD15)
NetU6_1: U6.1(PE2) ; port SPI4_SCK
NetU6_3: U6.3(PE4) ; port SPI4_NSS
NetU6_5: U6.5(PE6) ; port SPI4_MOSI
NetU6_23: U6.23(PA0) ; port UART4_TX
NetU6_24: U6.24(PA1) ; port UART4_RX
NetU6_35: U6.35(PB0) ; port SPI3_MOSI
NetU6_38: U6.38(PE7) ; port UART5_TX
NetU6_39: U6.39(PE8) ; port UART5_RX
NetU6_44: U6.44(PE13) ; port MC_1_ENABLE
NetU6_45: U6.45(PE14) ; port MC_2_ENABLE
NetU6_46: U6.46(PE15) ; port STEERING_ENABLE
NetU6_65: U6.65(PC8) ; port UART5_RTS
NetU6_66: U6.66(PC9) ; port UART5_CTS
NetU6_72: U6.72(PA13) ; port SWDIO
NetU6_76: U6.76(PA14) ; port SWCLK
NetU6_77: U6.77(PA15) ; port SPI3_NSS
NetU6_78: U6.78(PC10) ; port SPI3_SCK
NetU6_80: U6.80(PC12) ; port 5V_INT
NetU6_86: U6.86(PD5) ; port USART2_TX
NetU6_87: U6.87(PD6) ; port USART2_RX
NetU6_92: U6.92(PB6) ; port USART1_TX
NetU6_93: U6.93(PB7) ; port USART1_RX

Not connected (* = marked no-connect by the designer): C29 2; U6 37(PB2) 42(PE11) 43(PE12) 47(PB10) 68(PA9) 89(PB3) 90(PB4) 91(PB5) 95(PB8) 96(PB9)

### Notes on the sheet
- Bypass Caps for the MCU (placed close to each VDD pin)

### Library data of the parts
3 4 = 282834-6: as 12V_SIG on sheet 12V_SIGNAL_BULKHEAD; Part Number: 282834-6; Color: Green; ComponentLink1Description: Datasheet; ComponentLink1URL: https://www.te.com/commerce/DocumentDelivery/DDEController?Action=srchrtrv&DocNm=282834&DocType=Customer+Drawing&DocLang=English; ComponentLink2Description: DigiKey Link; ComponentLink2URL: http://digikey.com/product-detail/en/te-connectivity-amp-connectors/282834-6/A98337-ND/1153267; LastUpdated: 2020-01-15 4:16:31 AM; Lifecycle Status: Active; Minimum Order: 1; Mounting Type: Through Hole; Packaging: Bulk; Part Status: Active; Price: 4.72; Series: Buchanan; Supplier 1: DigiKey; Supplier Part Number 1: A98337-ND
C23 C24 = CMP-2006-02836-2: Chip Multilayer Ceramic Capacitors for General Purpose, 0603, 2.2uF, X7R, 15%, 10%, 10V; Case Code (Metric): 1608; Height: 0.8mm; Packaging: Cut Tape; Voltage: 10V; Lead Free: Lead Free; Min Operating Temperature: -55°C; Voltage Rating (DC): 10V; Max Operating Temperature: 125°C; Voltage Rating: 10V; Dielectric: X7R; Depth: 0.8mm; Case Code (Imperial): 0603; Termination: SMD/SMT; Case/Package: 0603; Number of Pins: 2; REACH SVHC: No SVHC; Mount: Surface Mount; Width: 0.031inch; Material: Ceramic; Capacitance: 2.2uF; Package Quantity: 1; Weight: 7.1E-05oz; Length: 1.6mm; Thickness: 0.035inch; Tolerance: 10%
C25 C27 = CBR08C809CAGAC: CAP CER 8PF 250V C0G/NP0 0805; Part Number: CBR08C809CAGAC; Value: 8 pF
C28-C34 = CC0805MRX7R9BB104: CAP CER 0.1UF 50V X7R 0805; Part Number: CC0805MRX7R9BB104; Value: 0.1 µF
C35-C37 = MM05ZC105KCZ2A: CAP CER 1UF 10V X7R 0805; Part Number: MM05ZC105KCZ2A; Value: 1µF
C44 = C0805X475J9RACAUTO: CAP CER 4.7UF 6.3V X7R 0805; Part Number: C0805X475J9RACAUTO; Value: 4.7 µF
DS12 DS13 = CMP-2000-06413-1: as DS5 on sheet boardPower; Datasheet Version: 07/2014; Category: LEDs; Datasheet URL: http://docs.avagotech.com/docs/AV02-1557EN; Packaging: Bulk; Pin Count: 2; Mounting Technology: ThroughHole; Package Reference: HLMP-4740; Mounting: ThroughHole; Manufacturer URL: http://www.avagotech.com/; Color: Green; Package: 2T-13/4; Package Description: 2-Pin Through Hole Device, Dia 5.845 mm, Pitch 2.54 mm
P3 P4 = CMP-1502-01068-2: NexarPartId: 32855526; Operating Supply Voltage: 250V; Number of Contacts: 5; Connector Type: Male Pin; Current Rating: 3A; Contact Resistance: 20mΩ; Pitch: 2.54mm; Gender: Male; Termination: Solder; RoHS: Compliant; Lead Pitch: 2.54mm; Contact Mating Length: 5.9944mm; Number of Positions: 5; Lead Free: Lead Free; Contact Plating: Gold; Number of Pins: 5; Min Operating Temperature: -40°C; Voltage Rating: 250V; Color: Black; Mount: Through Hole; REACH SVHC: Unknown; Packaging: Bulk; Height: 8.89mm; Number of Rows: 1; Orientation: Vertical; Contact Material: Copper; Max Operating Temperature: 105°C
R58 = RNCS0805BKE10K0: RES 10K OHM 0.1% 1/10W 0805; Manufacturer: Stackpole Electronics Inc; Power (Watts): 0.1W, 1/10W; Temperature Coefficient: ±25ppm/°C; Part Number: RNCS0805BKE10K0; Value: 10 kOhms; ComponentLink1Description: Datasheet; ComponentLink1URL: https://www.seielect.com/catalog/sei-rncs_rnch.pdf; ComponentLink2Description: DigiKey Link; ComponentLink2URL: https://www.digikey.com/en/products/detail/stackpole-electronics-inc/RNCS0805BKE10K0/1800067; Composition: Thin Film; Device Package: 0805 (2012 Metric); Features: Anti-Corrosive, Automotive AEC-Q200, Moisture Resistant; Height - Seated (Max): 0.026" (0.65mm); LastUpdated: 2023-10-12 7:56:55 PM; Lifecycle Status: Active; Minimum Order: 1; Number of Terminations: 2; Operating Temperature: -55°C ~ 155°C; Package / Case: 0805 (2012 Metric); Packaging: TapeAndReel; PartId: 27713; Part Status: Active; Price: 0.07; Ratings: AEC-Q200; Resistance: 10 kOhms; Series: RNCS; Size / Dimension: 0.079" L x 0.049" W (2.00mm x 1.25mm); Supplier 1: DigiKey; Supplier Part Number 1: RNCS0805BKE10K0CT-ND; Supplier Device Package: 0805; Tolerance: ±0.1%
R59 R61 = CMP-00030-39746512-1: as R40 on sheet boardPower; Weight: 519.986953mg; Number of Pins: 2; Min Operating Temperature: -40°C; Case/Package: Axial; Schedule B: 8533210080, 8533210080; Features: Flame Retardant Coating; Power Rating: 1W; Max Power Dissipation: 1W; Packaging: Tape & Box (TB); RoHS: Compliant; REACH SVHC: Unknown; NexarPartId: 39746512; Temperature Coefficient: 180ppm/°C; Diameter: 4.3mm; Contact Plating: Tin; Radiation Hardening: No; Max Operating Temperature: 275°C; Length: 11mm; Tolerance: 5%; Composition: Wirewound; Number of Terminations: 2; Termination: Axial; Voltage Rating: 22V
R60 R62 = CMP-2100-03671-1: as R28 on sheet boardPower; Number of Pins: 2; Number of Terminations: 2; Datasheet URL: http://www.yageo.com/NewPortal/yageodocoutput?fileName=/pdf/R-Chip/PYu-RC_Group_51_RoHS_L_5.pdf; Length: 0.079inch; Package Description: 2-Pin Surface Mounted Device, Body 2 x 1.25 mm; Depth: 1.25mm; Height: 0.024inch; Military Standard: Not; Case/Package: 0805; Package Reference: 0805; RoHSCompliant: true; Lead Free: LeadFree; Packaging: TapeandReel; Package Quantity: 1; Datasheet Version: Rev. 5, 10/2016; Tolerance: 1%; Min Operating Temperature: -55degC; Voltage Rating: 150V; Composition: ThickFilm; Case Code (Imperial): 0805; Power Rating: 125mW; Width: 0.049inch; Case Code (Metric): 2012; Manufacturer URL: http://www.yageo.com/; Max Operating Temperature: 155degC; REACH SVHC: Unknown; Termination: SMD/SMT
S1 = AB11AH-HC: SWITCH PUSH SPST-NO 0.4VA 28V; Manufacturer: NKK Switches; Actuator Type: Round, Button; Color - Actuator/Cap: Red; Current Rating (Amps): 0.4VA (AC/DC); Switch Function: Off-Mom; Part Number: AB11AH-HC; Circuit: SPST-NO; ComponentLink1Description: Datasheet; ComponentLink1URL: https://www.nkkswitches.com/pdf/Apushbuttons.pdf; ComponentLink2Description: DigiKey Link; ComponentLink2URL: http://digikey.com/product-detail/en/nkk-switches/AB11AH-HC/360-2604-ND/1056046; Features: Sealed - Fully; LastUpdated: 2020-01-25 8:05:42 PM; Lifecycle Status: Active; Minimum Order: 1; Mounting Type: Through Hole, Right Angle; Operating Temperature: -30°C ~ 85°C; Packaging: Tray; Part Status: Active; Price: 5.00; Series: AB; Supplier 1: DigiKey; Supplier Part Number 1: 360-2604-ND; Termination Style: PC Pin; Type: Standard; Voltage Rating - AC: 28V; Voltage Rating - DC: 28V
U6 = CMP-12105-000075-1: IC MCU 32BIT 512KB FLASH 100LQFP; Manufacturer: STMicroelectronics; Ram Size: 128KBytes; Data Bus Width: 32bits; Max Junction Temp: +125°C; Number Of Adc Channels: 16; Max Supply Voltage: 3.6V; Nominal Supply Current: 1.4-86mA; Number Of Uart Channels: 6; Core Architecture: ARM Cortex-M4; Standoff Height: 0.05mm; Number Of A/D Converters: 3; Frequency: 180MHz; Number Of Cores: 1; Min Supply Voltage: 1.65V; Number Of Timers/Counters: 14; Number Of Usb Channels: 2; Number Of Spi Channels: 4; Interface: I2C,SPI,UART,USART,Parallel,CAN,USB,LIN,IrDA,I2S,Other; Memory Size: 512KBytes; Number Of I/Os: 81; Ambient Temperature Range High: +85°C; Mouser Description: ARM Microcontrollers - MCU High-performance and DSP with FPU, ARM Cortex-M4 MCU with 512 Kbytes Flash, 180 MHz CPU, Art Accelerator, SDRAM; Device Class L2: Embedded Processors and Controllers; Temperature Range Low: -40°C; Device Class L1: Integrated Circuits (ICs); RoHS: TRUE; Ipc Land Pattern Name: QFP50P1600X1600X160-100; Manufacturer Part Number: STM32F446VET6; Octopart: https://octopart.com/stm32f446vet6-stmicroelectronics-52642922; Package: LQFP100-1L; Automotive: No; Category: IC; ComponentLink2URL: https://www.st.com/resource/en/datasheet/stm32f446ve.pdf; Digikey Description: IC MCU 32BIT 512KB FLASH 100LQFP; Temperature Range High: +85°C; Memory Type: FLASH; Lead Free: Yes; Height: 1.6mm; ComponentLink2Description: Datasheet; Number Of I2C Channels: 4; Device Class L3: Microcontrollers; Temperature: -40°C to +85°C; Ambient Temperature Range Low: -40°C
Y1 = ABLS-8.000MHZ-SD7Y-T: CRYSTAL 8.0000MHZ 18PF SMD; Manufacturer: Abracon LLC; ESR (Equivalent Series Resistance): 80 Ohms; Frequency Stability: ±30ppm; Frequency Tolerance: ±15ppm; Operating Mode: Fundamental; Part Number: ABLS-8.000MHZ-SD7Y-T; ComponentLink1Description: Datasheet; ComponentLink1URL: https://abracon.com/Resonators/abls.pdf; ComponentLink2Description: DigiKey Link; ComponentLink2URL: https://www.digikey.com/en/products/detail/abracon-llc/ABLS-8-000MHZ-SD7Y-T/8581989; Frequency: 8 MHz; Height - Seated (Max): 0.165" (4.20mm); LastUpdated: 2023-10-12 8:28:08 PM; Lifecycle Status: Active; Load Capacitance: 18pF; Minimum Order: 1; Mounting Type: Surface Mount; Operating Temperature: -40°C ~ 85°C; Package / Case: HC-49/US; Packaging: CutTape; PartId: 25; Part Status: Active; Price: 0.27; Series: ABLS; Size / Dimension: 0.449" L x 0.185" W (11.40mm x 4.70mm); Supplier 1: DigiKey; Supplier Part Number 1: 535-14365-2-ND; Type: MHz Crystal; Value: 8 MHz

## Sheet CAN.SchDoc
size A4
Used 2 times, as channels CAN1, CAN2. Parts and nets are listed once, with the designators drawn on the sheet.
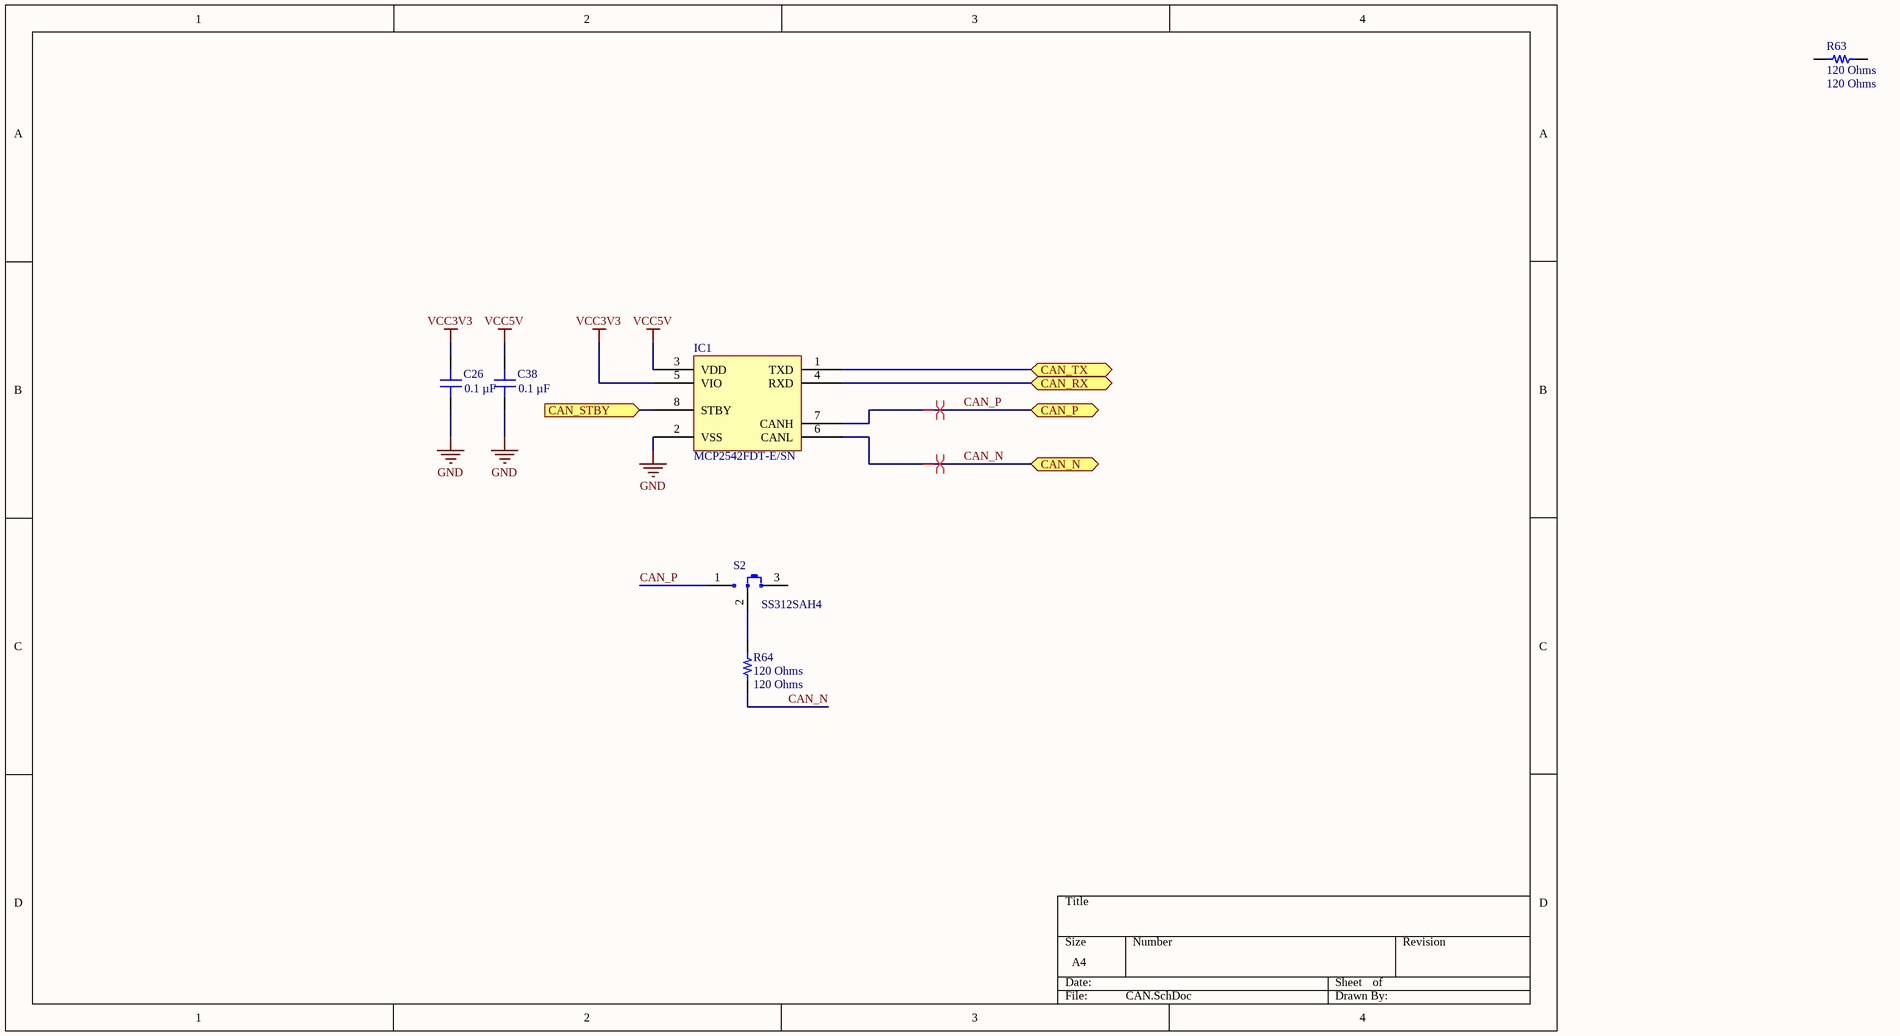
[diagram p7: CAN.SchDoc]

### Parts
C26  0.1 µF  [CAP 0805_2012]
C38  0.1 µF  [CAP 0805_2012]
IC1  MCP2542FDT-E/SN  [MICROCHIP SOIC-8 150MIL WIDE]
R63  120 Ohms  [RES 0805_2012]
R64  120 Ohms  [RES 0805_2012]
S2  SS312SAH4  [NKK SS312SAH4]

### Ports
CAN_N (bidir), CAN_P (bidir), CAN_RX (bidir), CAN_STBY (in), CAN_TX (bidir)

### Nets
GND: C26.1 C38.1 IC1.2(VSS)
VCC3V3: C26.2 IC1.5(VIO)
VCC5V: C38.2 IC1.3(VDD)
CAN_N: IC1.6(CANL) R64.1 ; port CAN_N
CAN_P: IC1.7(CANH) S2.1 ; port CAN_P
CAN_RX: IC1.4(RXD) ; port CAN_RX
CAN_STBY: IC1.8(STBY) ; port CAN_STBY
CAN_TX: IC1.1(TXD) ; port CAN_TX
NetR64_2: R64.2 S2.2(COM)

Not connected (* = marked no-connect by the designer): R63 1 2; S2 3

### Channels
CAN1: designators end in _CAN1; ports CAN_N=CAN1_N CAN_P=CAN1_P CAN_RX=CAN1_RX CAN_STBY=CAN1_STBY CAN_TX=CAN1_TX
CAN2: designators end in _CAN2; ports CAN_N=CAN2_N CAN_P=CAN2_P CAN_RX=CAN2_RX CAN_STBY=CAN2_STBY CAN_TX=CAN2_TX

### Layout directives
differential pair: CAN1_N, CAN1_P

### Library data of the parts
C26 C38 = CC0805MRX7R9BB104: as C2 on sheet 5V_TO_3V_VD; Part Number: CC0805MRX7R9BB104; Value: 0.1 µF; Applications: General Purpose; Capacitance: 0.1 µF; componentlink1description: Datasheet; componentlink1url: https://www.yageo.com/upload/media/product/productsearch/datasheet/mlcc/UPY-GPHC_X7R_6.3V-to-50V_18.pdf; componentlink2description: DigiKey Link; componentlink2url: https://www.digikey.com/en/products/detail/yageo/CC0805MRX7R9BB104/5884281; Device Package: 0805 (2012 Metric); lastupdated: 2023-10-12 7:14:35 PM; Lifecycle Status: Active; Minimum Order: 1; Mounting Type: Surface Mount, MLCC; Operating Temperature: -55°C ~ 125°C; Package / Case: 0805 (2012 Metric); packaging: TapeAndReel; partid: 2475; Part Status: Active; price: 0.01; series: CC; Size / Dimension: 0.079" L x 0.049" W (2.00mm x 1.25mm); Supplier 1: DigiKey; Supplier Part Number 1: 311-4351-1-ND; Temperature Coefficient: X7R; Thickness (Max): 0.037" (0.95mm); Voltage - Rated: 50V
IC1 = MCP2542FDT-E/SN: IC TRANSCEIVER 1/1 8SOIC; Manufacturer: Microchip Technology; Data Rate: 8Mbps; Protocol: CANbus; Receiver Hysteresis: 200mV; Voltage - Supply: 4.5V ~ 5.5V; Part Number: MCP2542FDT-E/SN; ComponentLink1Description: Datasheet; ComponentLink1URL: http://www.microchip.com/mymicrochip/filehandler.aspx?ddocname=en585412; ComponentLink2Description: DigiKey Link; ComponentLink2URL: http://digikey.com/product-detail/en/microchip-technology/MCP2542FDT-E-SN/MCP2542FDT-E-SNCT-ND/9642863; Device Package: 8-SOIC (0.154", 3.90mm Width); LastUpdated: 2020-05-24 11:07:13 PM; Lifecycle Status: Active; Minimum Order: 1; Mounting Type: Surface Mount; Number of Drivers/Receivers: 1/1; Operating Temperature: -40°C ~ 125°C; Package / Case: 8-SOIC (0.154", 3.90mm Width); Packaging: TapeAndReel; Part Status: Active; Price: 0.59; Series: -; Supplier 1: DigiKey; Supplier Part Number 1: MCP2542FDT-E/SNCT-ND; Supplier Device Package: 8-SOIC; Type: Transceiver
R63 R64 = ERJ-6ENF1200V: RES SMD 120 OHM 1% 1/8W 0805; Part Number: ERJ-6ENF1200V; Value: 120 Ohms
S2 = SS312SAH4: SWITCH SLIDE SPDT 0.4VA 28V; Manufacturer: NKK Switches; Actuator Length: 2.00mm; Actuator Type: Standard; Contact Timing: Shorting (MBB); Current Rating (Amps): 0.4VA (AC/DC); Switch Function: On-On; Part Number: SS312SAH4; Circuit: SPDT; ComponentLink1Description: Datasheet; ComponentLink1URL: http://www.nkkswitches.com/pdf/SS3surfaceMount-1.pdf; ComponentLink2Description: DigiKey Link; ComponentLink2URL: http://digikey.com/product-detail/en/nkk-switches/SS312SAH4/360-3250-ND/1052031; Contact Finish: Gold; Contact Material: Phosphor Bronze; LastUpdated: 2020-01-04 7:15:23 PM; Lifecycle Status: Active; Minimum Order: 1; Mounting Type: Surface Mount, Right Angle; Operating Temperature: -25°C ~ 85°C; Packaging: Tray; PartId: 2; Part Status: Active; Price: 3.02; Series: SS3; Supplier 1: DigiKey; Supplier Part Number 1: 360-3250-ND; Termination Style: Gull Wing; Voltage Rating - AC: 28V; Voltage Rating - DC: 28V

## Sheet IMU.SchDoc
size A4
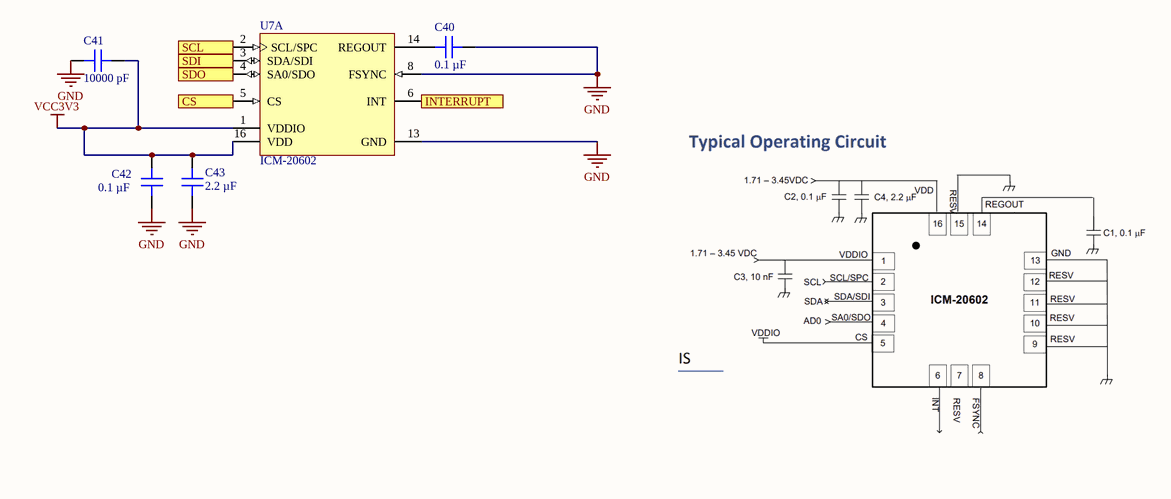
[diagram p8: IMU.SchDoc]

### Parts
C40  0.1 µF  [CAP 0603_1608]
C41  10000 pF  [CAP 0603_1608]
C42  0.1 µF  [CAP 0603_1608]
C43  2.2 µF  [CAP 0603_1608]
U7  ICM-20602  [INSE-I62-16]  (part A of 2)

### Ports
CS, INTERRUPT, SCL, SDI, SDO

### Nets
GND: C40.2 C41.1 C42.1 C43.1 U7.8(FSYNC) U7.13(GND)
VCC3V3: C41.2 C42.2 C43.2 U7.1(VDDIO) U7.16(VDD)
AC_CS: U7.5(CS) ; port CS
AC_INT: U7.6(INT) ; port INTERRUPT
AC_SCL: U7.2(SCL/SPC) ; port SCL
AC_SDI: U7.3(SDA/SDI) ; port SDI
AC_SDO: U7.4(SA0/SDO) ; port SDO
NetC40_1: C40.1 U7.14(REGOUT)

### Library data of the parts
C40 C42 = C0603C104K5RAC7411: CAP CER 0.1UF 50V X7R 0603; manufacturer: KEMET; Tolerance: ±10%; Part Number: C0603C104K5RAC7411; Value: 0.1 µF; Applications: Bypass, Decoupling; Capacitance: 0.1 µF; componentlink1description: Datasheet; componentlink1url: https://api.kemet.com/component-edge/download/datasheet/C0603C104K5RAC7411.pdf; componentlink2description: DigiKey Link; componentlink2url: https://www.digikey.com/en/products/detail/kemet/C0603C104K5RAC7411/3317013; Device Package: 0603 (1608 Metric); lastupdated: 2023-06-07 7:13:18 PM; Lifecycle Status: Active; Minimum Order: 1; Mounting Type: Surface Mount, MLCC; Operating Temperature: -55°C ~ 125°C; Package / Case: 0603 (1608 Metric); packaging: TapeAndReel; partid: 2233; Part Status: Active; price: 0.01; series: SMD Comm X7R; Size / Dimension: 0.063" L x 0.031" W (1.60mm x 0.80mm); Supplier 1: DigiKey; Supplier Part Number 1: 399-C0603C104K5RAC7411CT-ND; Temperature Coefficient: X7R; Thickness (Max): 0.035" (0.90mm); Voltage - Rated: 50V
C41 = C0603C103K4RECAUTO: CAP CER 0603 10NF 16V X7R 10%; manufacturer: KEMET; Part Number: C0603C103K4RECAUTO; Value: 10000 pF; Applications: Automotive, ESD Protection; Capacitance: 10000 pF; componentlink1description: Datasheet; componentlink1url: https://api.kemet.com/component-edge/download/datasheet/C0603C103K4RECAUTO.pdf; componentlink2description: DigiKey Link; componentlink2url: https://www.digikey.com/en/products/detail/kemet/C0603C103K4RECAUTO/8640474; Device Package: 0603 (1608 Metric); lastupdated: 2023-06-07 7:13:03 PM; Lifecycle Status: Active; Minimum Order: 1; Mounting Type: Surface Mount, MLCC; Operating Temperature: -55°C ~ 125°C; Package / Case: 0603 (1608 Metric); packaging: TapeAndReel; partid: 8251; Part Status: Active; price: 0.01; Ratings: AEC-Q200; series: ESD SMD Auto X7R; Size / Dimension: 0.063" L x 0.031" W (1.60mm x 0.80mm); Supplier 1: DigiKey; Supplier Part Number 1: 399-17880-1-ND; Temperature Coefficient: X7R; Thickness (Max): 0.034" (0.87mm); Tolerance: ±10%; Voltage - Rated: 16V
C43 = CC0603ZRY5V6BB225: CAP CER 2.2UF 10V Y5V 0603; manufacturer: Yageo; Temperature Coefficient: Y5V (F); Tolerance: -20%, +80%; Part Number: CC0603ZRY5V6BB225; Value: 2.2 µF; Applications: General Purpose; Capacitance: 2.2 µF; componentlink1description: Datasheet; componentlink1url: http://www.yageo.com/documents/recent/UPY-GPHC_Y5V_6.3V-to-50V_8.pdf; componentlink2description: DigiKey Link; componentlink2url: https://www.digikey.com/en/products/detail/yageo/CC0603ZRY5V6BB225/2833615; Device Package: 0603 (1608 Metric); lastupdated: 2023-06-07 7:13:18 PM; Lifecycle Status: Active; Minimum Order: 1; Mounting Type: Surface Mount, MLCC; Operating Temperature: -30°C ~ 85°C; Package / Case: 0603 (1608 Metric); packaging: TapeAndReel; partid: 2248; Part Status: Active; price: 0.01; series: CC; Size / Dimension: 0.063" L x 0.031" W (1.60mm x 0.80mm); Supplier 1: DigiKey; Supplier Part Number 1: 311-1450-1-ND; Thickness (Max): 0.035" (0.90mm); Voltage - Rated: 10V
U7 = CMP-2000-07589-1: High Performance 6-Axis MEMS MotionTracking(TM) Device, 1.71 to 3.45 V, -40 to 85 degC, 16-Pin LGA, RoHS; Manufacturer: InvenSense; Sensor Type: Temperature; Output Type: I2C; RoHSCompliant: True; Datasheet Version: Rev. 1.0, 10/2016; Datasheet URL: http://www.invensense.com/wp-content/uploads/2016/10/DS-000176-ICM-20602-v1.0.pdf; Min Operating Temperature: -40degC; Mounting Technology: SurfaceMount; Max Operating Temperature: 85degC; Manufacturer URL: http://www.invensense.com/; Package Reference: I62-16; Package Description: 16-Pin Land Grid Array, Body 3 x 3 mm, Pitch 0.5 mm

## Sheet Connectors.SchDoc
size A4
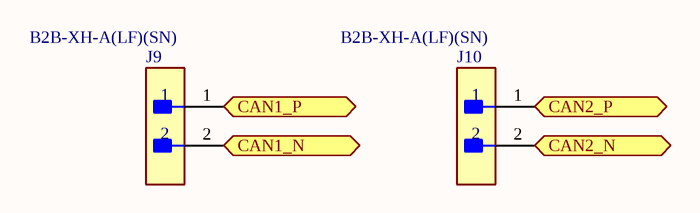
[diagram p9: Connectors.SchDoc]

### Parts
J9  B2B-XH-A(LF)(SN)  [FP-B2B-XH-A_LF_SN-MFG]
J10  B2B-XH-A(LF)(SN)  [FP-B2B-XH-A_LF_SN-MFG]

### Ports
CAN1_N (bidir), CAN1_P (bidir), CAN2_N (bidir), CAN2_P (bidir)

### Nets
NetJ9_1: J9.1 ; port CAN1_P
NetJ9_2: J9.2 ; port CAN1_N
NetJ10_1: J10.1 ; port CAN2_P
NetJ10_2: J10.2 ; port CAN2_N

### Library data of the parts
J9 J10 = CMP-2000-05888-3: CONN HEADER VERT 2POS 2.5MM; Current Rating: 3A; Voltage Rating: 250V; Number of Contacts: 2; Contact Resistance: 20mR; Wire/Cable Gauge: 22AWG; Insulation Resistance: 1GR; Connector Type: Male Pin; Packaging: Bulk; Contact Material: Brass; Lead Free: Lead Free; Orientation: Straight; Contact Plating: Tin; Max Current Rating: 3A; Termination: Solder; Fastening Type: Detent; Depth: 5.75mm; Housing Material: Polyamide; REACH SVHC: No SVHC; Series: XH; Voltage Rating (AC): 250V; Number of Positions: 2; Color: Natural; Contact Type: Male Pin; Max Voltage Rating (DC): 250V; Pitch: 2.5mm; Lead Pitch: 2.5mm; Mount: Through Hole; Max Operating Temperature: 85°C; Length: 7.4mm; Max Voltage Rating (AC): 250V; Min Operating Temperature: -25°C; Number of Rows: 1; Housing Color: White

## Sheet Debugger.SchDoc
size A4
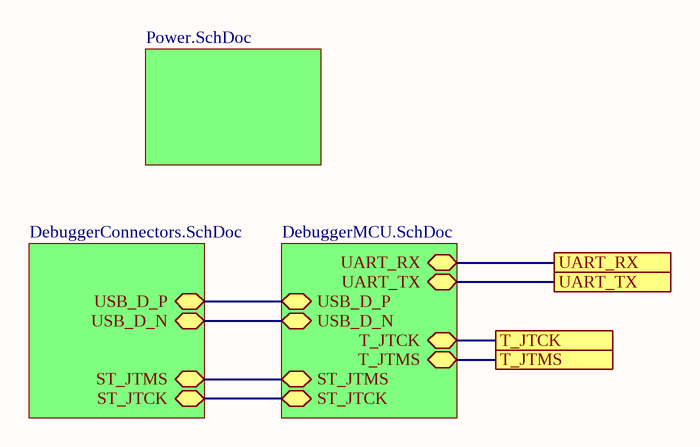
[diagram p10: Debugger.SchDoc]

### Sub-sheets
CONNECTORS = DebuggerConnectors.SchDoc (file not in this document): USB_D_P (bidir), USB_D_N (bidir), ST_JTMS (bidir), ST_JTCK (bidir)
MCU = DebuggerMCU.SchDoc (file not in this document): UART_RX (bidir), UART_TX (bidir), USB_D_P (bidir), USB_D_N (bidir), T_JTCK (bidir), T_JTMS (bidir), ST_JTMS (bidir), ST_JTCK (bidir)
POWER = Power.SchDoc: no entries

### Ports
T_JTCK, T_JTMS, UART_RX, UART_TX

### Nets
(unnamed): port T_JTCK, sheet MCU/T_JTCK
(unnamed): port T_JTMS, sheet MCU/T_JTMS
(unnamed): port UART_RX, sheet MCU/UART_RX
(unnamed): port UART_TX, sheet MCU/UART_TX
(unnamed): sheet MCU/USB_D_P, sheet CONNECTORS/USB_D_P
(unnamed): sheet MCU/USB_D_N, sheet CONNECTORS/USB_D_N
(unnamed): sheet MCU/ST_JTMS, sheet CONNECTORS/ST_JTMS
(unnamed): sheet MCU/ST_JTCK, sheet CONNECTORS/ST_JTCK

## Sheet Power.SchDoc
size A4
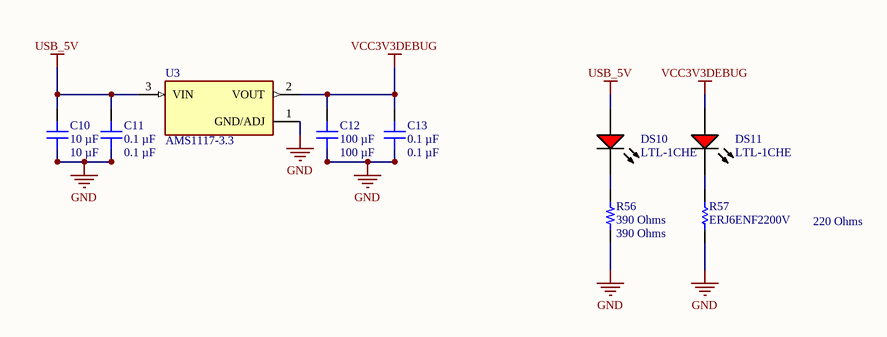
[diagram p11: Power.SchDoc]

### Parts
C10  10 µF  [CAP 0805_2012]
C11  0.1 µF  [CAP 0805_2012]
C12  100 µF  [CAP 0805_2012]
C13  0.1 µF  [CAP 0805_2012]
DS10  LTL-1CHE  [INDPR60-254-520X380X650]
DS11  LTL-1CHE  [INDPR60-254-520X380X650]
R56  390 Ohms  [RES 0805_2012]
R57  ERJ6ENF2200V  [RESC2013X70X40NL20T20]
U3  AMS1117-3.3  [SOT229P700X180-4N]

### Nets
GND: C10.1 C11.1 C12.1 C13.1 R56.1 R57.1 U3.1(GND/ADJ)
USB_5V: C10.2 C11.2 DS10.1(A) U3.3(VIN)
VCC3V3DEBUG: C12.2 C13.2 DS11.1(A) U3.2(VOUT)
NetDS10_2: DS10.2(K) R56.2
NetDS11_2: DS11.2(K) R57.2

### Notes on the sheet
- 220 Ohms

### Library data of the parts
C10 = CL21Y106KPQVPNE: CAP CER 10UF 10V X7S 0805; Part Number: CL21Y106KPQVPNE; Value: 10 µF
C11 C13 = CC0805MRX7R9BB104: CAP CER 0.1UF 50V X7R 0805; Part Number: CC0805MRX7R9BB104; Value: 0.1 µF
C12 = PMK212BBJ107MG-T: CAP CER 100UF 2.5V X5R 0805; Part Number: PMK212BBJ107MG-T; Value: 100 µF
DS10 DS11 = CMP-1674-00005-1: Radial LED, 12.6 mcd, 20 mA, 2 V, -55 to 100 degC, 2-Pin THD, RoHS, Bulk; Shielding: Unshielded; Resistance: 0.045 Ohm; Current Rating: 3.6 A; Tolerance: 20%; PackageReference: LTL-1CHE; PackageDescription: 2-Pin Through Hole Device, Dia 3.8 mm, Pitch 2.54 mm; Case\Package: Radial; Length: 0.97 inch; Width: 0.62 inch; Height: 1.1 inch; Radiation Hardening: No; Lead Pitch: 11.44 mm; ComponentLink1URL: http://www.us.liteon.com/; ComponentLink1Description: Manufacturer URL; RoHSCompliant: true; Packaging: Tray; Mount: Through Hole; Min Operating Temperature: -40 degC; Max Operating Temperature: 130 degC; ComponentLink2URL: https://datasheet.ciiva.com/15117/getdatasheetpartid-187746-15117985.pdf; Package Quantity: 55; ComponentLink2Description: Datasheet; DatasheetVersion: Dec-03
R56 = CRGP0805F390R: RES 390 OHM 1% 1/3W 0805; Part Number: CRGP0805F390R; Value: 390 Ohms
R57 = CMP-2001-00044-1: Manufacturer: Panasonic; Part Number: ERJ6ENF2200V
U3 = AMS1117-3.3: as U5 on sheet LDO; Package: SOT-223 Seeed Technology; Value: *; Check_prices: https://www.snapeda.com/parts/AMS1117-3.3/Advanced+Monolithic+Systems/view-part/?ref=eda; Price: None; Availability: Not in stock; MP: AMS1117-3.3; SnapEDA_Link: https://www.snapeda.com/parts/AMS1117-3.3/Advanced+Monolithic+Systems/view-part/?ref=snap

## Nets that join several sheets
GND: 5V_TO_3V_VD (C2.1 R3.1), 5V_LS (C7.1 C8.1 R13.1 U.4), boardPower (9 pins), Buck (13 pins), LDO (9 pins), STM32 (25 pins), CAN1 (5 pins), CAN2 (5 pins), IMU (6 pins), Power (7 pins)
VCC3V3: 5V_LS (R12.2), LDO (C20.2 C21.2 R38.2 U5.2), STM32 (18 pins), CAN1 (C26_CAN1.2 IC1_CAN1.5), CAN2 (C26_CAN2.2 IC1_CAN2.5), IMU (5 pins)
VCC12V: boardPower (7 pins), Buck (C15.2 C16.2 R51.2 U4.1)
AC_CS: STM32 (U6.82), IMU (U7.5)
AC_INT: STM32 (U6.79), IMU (U7.6)
AC_SCL: STM32 (U6.84), IMU (U7.2)
AC_SDI: STM32 (U6.54), IMU (U7.3)
AC_SDO: STM32 (U6.17), IMU (U7.4)
CAN1_RX: STM32 (U6.70), CAN1 (IC1_CAN1.4)
CAN1_STBY: STM32 (U6.69), CAN1 (IC1_CAN1.8)
CAN1_TX: STM32 (U6.71), CAN1 (IC1_CAN1.1)
CAN2_RX: STM32 (U6.51), CAN2 (IC1_CAN2.4)
CAN2_STBY: STM32 (U6.53), CAN2 (IC1_CAN2.8)
CAN2_TX: STM32 (U6.52), CAN2 (IC1_CAN2.1)